# EAGLE design LED-driver (EAGLE 7.1.0)
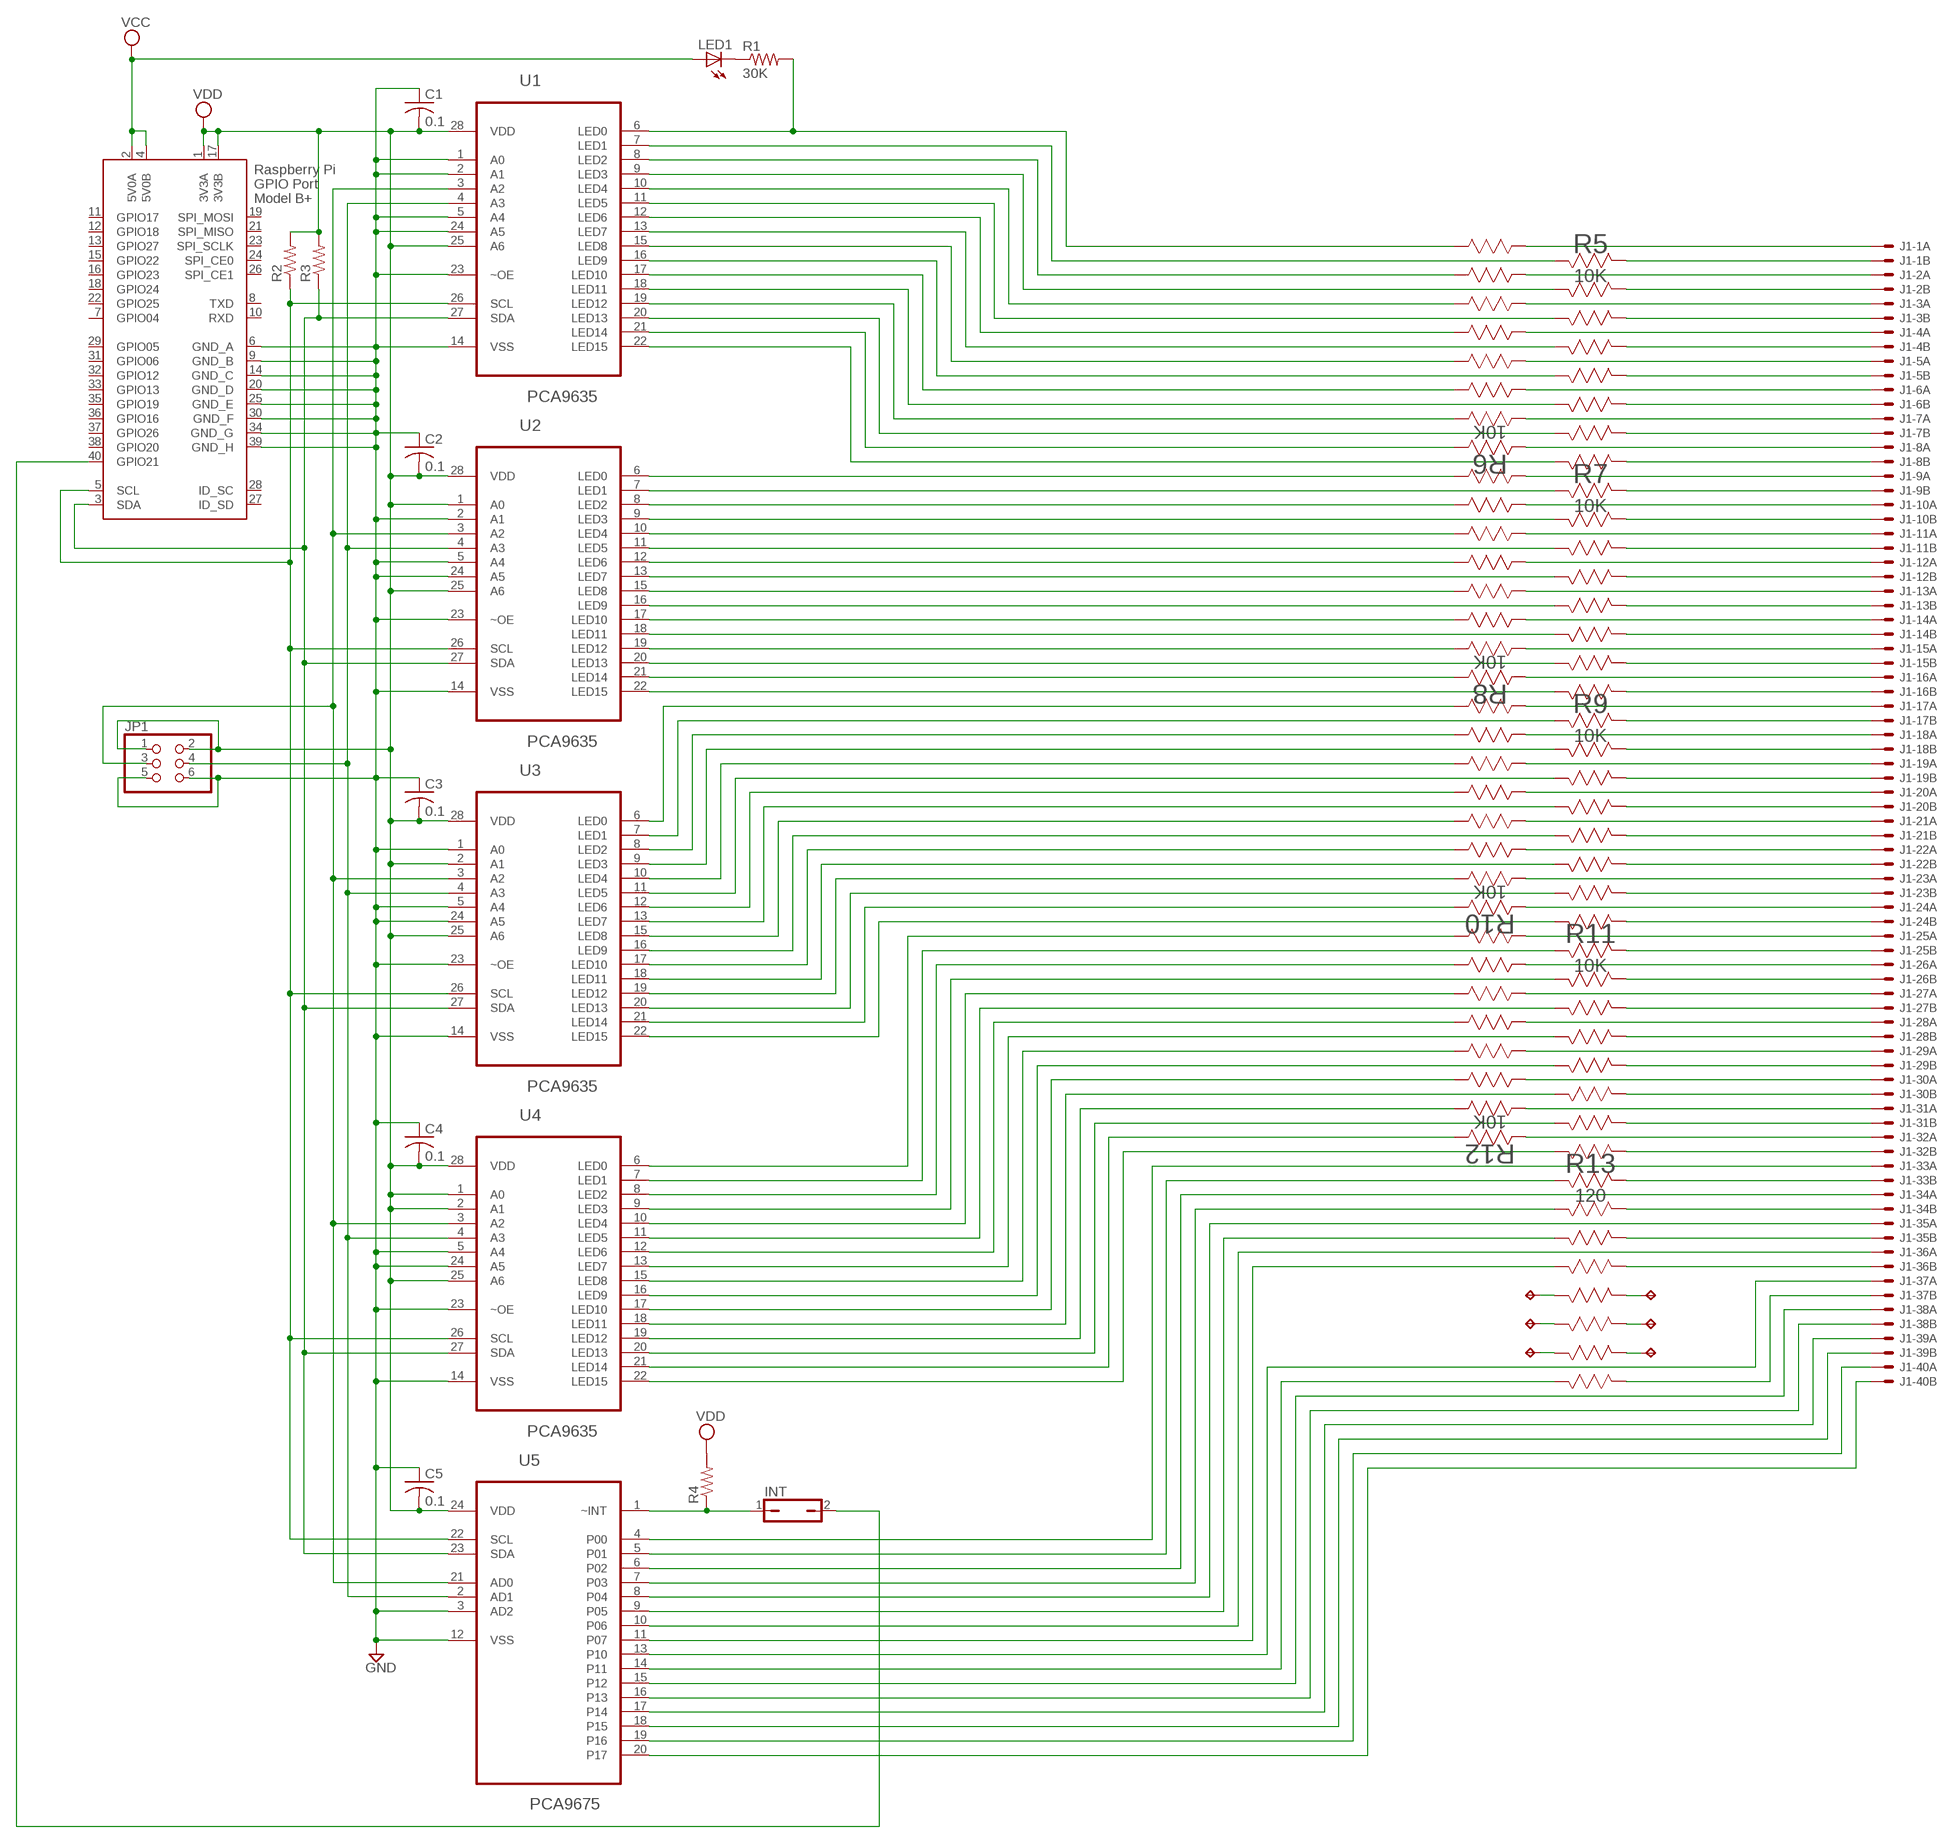
[diagram p0: schematic, sheet 1]

## Parts
C1  0.1  C-US025-030X050  [C025-030X050]
C2  0.1  C-US025-030X050  [C025-030X050]
C3  0.1  C-US025-030X050  [C025-030X050]
C4  0.1  C-US025-030X050  [C025-030X050]
C5  0.1  C-US025-030X050  [C025-030X050]
INT  JP1Q  [JP1]
J1  CON-80-EDGE  [CARDEDGE-80]
JP1  JUMPER-3X2  [3X2]
LED1  LED5MM  [LED5MM]
R1  30K  R-US_0207/10  [0207/10]
R2  R-US_0207/10  [0207/10]
R3  R-US_0207/10  [0207/10]
R4  R-US_0207/10  [0207/10]
R5  10K  CTS  [SOMC16-M]
R6  10K  CTS  [SOMC16-M]
R7  10K  CTS  [SOMC16-M]
R8  10K  CTS  [SOMC16-M]
R9  10K  CTS  [SOMC16-M]
R10  10K  CTS  [SOMC16-M]
R11  10K  CTS  [SOMC16-M]
R12  10K  CTS  [SOMC16-M]
R13  120  CTS  [SOMC16-M]
TP1  TP  [TP]
TP2  TP  [TP]
TP3  TP  [TP]
TP4  TP  [TP]
TP5  TP  [TP]
TP6  TP  [TP]
U1  PCA9635  [SOP65P640X110-28N]
U2  PCA9635  [SOP65P640X110-28N]
U3  PCA9635  [SOP65P640X110-28N]
U4  PCA9635  [SOP65P640X110-28N]
U5  PCA9675  [SOP65P640X110-24N]
X1  RASPI_BOARD_B+#_E4  [RASPI_BOARD_B+_EDGES_4DRILL]

## Nets
GND: C1.1 C2.1 C3.1 C4.1 C5.1 JP1.5 JP1.6 U1.1(A0) U1.2(A1) U1.5(A4) U1.14(VSS) U1.23(~OE) U1.24(A5) U2.2(A1) U2.5(A4) U2.14(VSS) U2.23(~OE) U2.24(A5) U3.1(A0) U3.5(A4) U3.14(VSS) U3.23(~OE) U3.24(A5) U4.5(A4) U4.14(VSS) U4.23(~OE) U4.24(A5) U5.3(AD2) U5.12(VSS) X1.6(GND_A) X1.9(GND_B) X1.14(GND_C) X1.20(GND_D) X1.25(GND_E) X1.30(GND_F) X1.34(GND_G) X1.39(GND_H)
N$1: R1.2 R6.9 U1.6(LED0)
N$2: R5.16 U1.7(LED1)
N$3: R6.10 U1.8(LED2)
N$4: R5.15 U1.9(LED3)
N$5: R6.11 U1.10(LED4)
N$6: R5.14 U1.11(LED5)
N$7: R6.12 U1.12(LED6)
N$8: R5.13 U1.13(LED7)
N$9: R6.13 U1.15(LED8)
N$10: R5.12 U1.16(LED9)
N$11: R6.14 U1.17(LED10)
N$12: R5.11 U1.18(LED11)
N$13: R6.15 U1.19(LED12)
N$14: R5.10 U1.20(LED13)
N$15: R6.16 U1.21(LED14)
N$16: R5.9 U1.22(LED15)
N$17: J1.36A U5.10(P06)
N$18: R3.1 U1.27(SDA) U2.27(SDA) U3.27(SDA) U4.27(SDA) U5.23(SDA) X1.3(SDA)
N$19: R8.9 U2.6(LED0)
N$20: R2.1 U1.26(SCL) U2.26(SCL) U3.26(SCL) U4.26(SCL) U5.22(SCL) X1.5(SCL)
N$21: R13.13 U5.11(P07)
N$22: R7.16 U2.7(LED1)
N$23: R8.10 U2.8(LED2)
N$24: R7.15 U2.9(LED3)
N$25: R8.11 U2.10(LED4)
N$26: R7.14 U2.11(LED5)
N$27: R8.12 U2.12(LED6)
N$28: R7.13 U2.13(LED7)
N$29: R8.13 U2.15(LED8)
N$30: R7.12 U2.16(LED9)
N$31: R8.14 U2.17(LED10)
N$32: R7.11 U2.18(LED11)
N$33: R8.15 U2.19(LED12)
N$34: R7.10 U2.20(LED13)
N$35: R8.16 U2.21(LED14)
N$36: R7.9 U2.22(LED15)
N$37: R10.9 U3.6(LED0)
N$38: R9.16 U3.7(LED1)
N$39: R10.10 U3.8(LED2)
N$40: R9.15 U3.9(LED3)
N$41: R10.11 U3.10(LED4)
N$42: R9.14 U3.11(LED5)
N$43: R10.12 U3.12(LED6)
N$44: R9.13 U3.13(LED7)
N$45: R10.13 U3.15(LED8)
N$46: R9.12 U3.16(LED9)
N$47: R10.14 U3.17(LED10)
N$48: R9.11 U3.18(LED11)
N$49: R10.15 U3.19(LED12)
N$50: R9.10 U3.20(LED13)
N$51: R10.16 U3.21(LED14)
N$52: R9.9 U3.22(LED15)
N$53: R12.9 U4.6(LED0)
N$54: R11.16 U4.7(LED1)
N$55: R12.10 U4.8(LED2)
N$56: R11.15 U4.9(LED3)
N$57: R12.11 U4.10(LED4)
N$58: R11.14 U4.11(LED5)
N$59: R12.12 U4.12(LED6)
N$60: R11.13 U4.13(LED7)
N$61: R12.13 U4.15(LED8)
N$62: R11.12 U4.16(LED9)
N$63: R12.14 U4.17(LED10)
N$64: R11.11 U4.18(LED11)
N$65: R12.15 U4.19(LED12)
N$66: R11.10 U4.20(LED13)
N$67: R12.16 U4.21(LED14)
N$68: R11.9 U4.22(LED15)
N$69: J1.33A U5.4(P00)
N$70: R13.16 U5.5(P01)
N$71: J1.34A U5.6(P02)
N$72: R13.15 U5.7(P03)
N$73: J1.35A U5.8(P04)
N$74: R13.14 U5.9(P05)
N$75: JP1.3 U1.3(A2) U2.3(A2) U3.3(A2) U4.3(A2) U5.21(AD0)
N$76: JP1.4 U1.4(A3) U2.4(A3) U3.4(A3) U4.4(A3) U5.2(AD1)
N$77: J1.37A U5.13(P10)
N$78: R13.9 U5.14(P11)
N$79: J1.38A U5.15(P12)
N$80: J1.38B U5.16(P13)
N$81: J1.39A U5.17(P14)
N$82: J1.39B U5.18(P15)
N$83: J1.40A U5.19(P16)
N$84: J1.40B U5.20(P17)
N$85: LED1.K(C) R1.1
N$86: J1.1A R6.8
N$87: J1.2A R6.7
N$88: INT.1 R4.1 U5.1(~INT)
N$89: INT.2 X1.40(GPIO21)
N$90: J1.3A R6.6
N$91: J1.4A R6.5
N$92: J1.5A R6.4
N$93: J1.6A R6.3
N$94: J1.7A R6.2
N$95: J1.8A R6.1
N$96: J1.1B R5.1
N$97: J1.2B R5.2
N$98: J1.3B R5.3
N$99: J1.4B R5.4
N$100: J1.5B R5.5
N$101: J1.6B R5.6
N$102: J1.7B R5.7
N$103: J1.8B R5.8
N$104: J1.9B R7.1
N$105: J1.10B R7.2
N$106: J1.11B R7.3
N$107: J1.12B R7.4
N$108: J1.13B R7.5
N$109: J1.14B R7.6
N$110: J1.15B R7.7
N$111: J1.16B R7.8
N$112: J1.9A R8.8
N$113: J1.10A R8.7
N$114: J1.11A R8.6
N$115: J1.12A R8.5
N$116: J1.13A R8.4
N$117: J1.14A R8.3
N$118: J1.15A R8.2
N$119: J1.16A R8.1
N$120: J1.17B R9.1
N$121: J1.18B R9.2
N$122: J1.19B R9.3
N$123: J1.20B R9.4
N$124: J1.21B R9.5
N$125: J1.22B R9.6
N$126: J1.23B R9.7
N$127: J1.24B R9.8
N$128: J1.25B R11.1
N$129: J1.26B R11.2
N$130: J1.27B R11.3
N$131: J1.28B R11.4
N$132: J1.29B R11.5
N$133: J1.30B R11.6
N$134: J1.31B R11.7
N$135: J1.32B R11.8
N$136: J1.33B R13.1
N$137: J1.34B R13.2
N$138: J1.35B R13.3
N$139: J1.36B R13.4
N$140: J1.37B R13.8
N$141: J1.17A R10.8
N$142: J1.18A R10.7
N$143: J1.19A R10.6
N$144: J1.20A R10.5
N$145: J1.21A R10.4
N$146: J1.22A R10.3
N$147: J1.23A R10.2
N$148: J1.24A R10.1
N$149: J1.25A R12.8
N$150: J1.26A R12.7
N$151: J1.27A R12.6
N$152: J1.28A R12.5
N$153: J1.29A R12.4
N$154: J1.30A R12.3
N$155: J1.31A R12.2
N$156: J1.32A R12.1
N$157: R13.12 TP1.1(TP)
N$158: R13.11 TP2.1(TP)
N$159: R13.10 TP3.1(TP)
N$160: R13.5 TP4.1(TP)
N$161: R13.6 TP5.1(TP)
N$162: R13.7 TP6.1(TP)
VCC: LED1.A X1.2(5V0A) X1.4(5V0B)
VDD: C1.2 C2.2 C3.2 C4.2 C5.2 JP1.1 JP1.2 R2.2 R3.2 R4.2 U1.25(A6) U1.28(VDD) U2.1(A0) U2.25(A6) U2.28(VDD) U3.2(A1) U3.25(A6) U3.28(VDD) U4.1(A0) U4.2(A1) U4.25(A6) U4.28(VDD) U5.24(VDD) X1.1(3V3A) X1.17(3V3B)
Unconnected: X1.7(GPIO04) X1.8(TXD) X1.10(RXD) X1.11(GPIO17) X1.12(GPIO18) X1.13(GPIO27) X1.15(GPIO22) X1.16(GPIO23) X1.18(GPIO24) X1.19(SPI_MOSI) X1.21(SPI_MISO) X1.22(GPIO25) X1.23(SPI_SCLK) X1.24(SPI_CE0) X1.26(SPI_CE1) X1.27(ID_SD) X1.28(ID_SC) X1.29(GPIO05) X1.31(GPIO06) X1.32(GPIO12) X1.33(GPIO13) X1.35(GPIO19) X1.36(GPIO16) X1.37(GPIO26) X1.38(GPIO20)

## Library data of the parts
C1-C5 = resistor:C-US: CAPACITOR, American symbol
INT = jumper:JP1Q: JUMPER
J1 = card-edge-80:CON-80: Connector 80-pin
JP1 = Casner:JUMPER-3X2: JUMPER PATTERN
LED1 = led:LED: LED OSRAM: - CHIPLED LG R971, LG N971, LY N971, LG Q971, LY Q971, LO R971, LY R971 LH N974, LH R974 LS Q976, LO Q976, LY Q976 LO Q996 - Hyper CHIPLED LW Q18S LB Q993, LB Q99A, LB R99A - SideLED LS A670, LO A670, LY A670, LG A670, LP A670 LB A673, LV A673, LT A673, LW A673 LH A674 LY A675 LS A676, LA A676, LO A676, LY A676, LW A676 LS A679, LY A679, LG A679 - Hyper Micro SIDELED® LS Y876, LA Y876, LO Y876, LY Y876 LT Y87S - SmartLED LW L88C, LW L88S LB L89C, LB L89S, LG L890 LS L89K, LO L89K, LY L89K LS L896, LA L896, LO L896, LY L896 - TOPLED LS T670, LO T670, LY T670, LG T670, LP T670 LSG T670, LSP T670, LSY T670, LOP T670, LYG T670 LG T671, LOG T671, LSG T671 LB T673, LV T673, LT T673, LW T673 LH T674 LS T676, LA T676, LO T676, LY T676, LB T676, LH T676, LSB T676, LW T676 LB T67C, LV T67C, LT T67C, LS T67K, LO T67K, LY T67K, LW E67C LS E67B, LA E67B, LO E67B, LY E67B, LB E67C, LV E67C, LT E67C LW T67C LS T679, LY T679, LG T679 LS T770, LO T770, LY T770, LG T770, LP T770 LB T773, LV T773, LT T773, LW T773 LH T774 LS E675, LA E675, LY E675, LS T675 LS T776, LA T776, LO T776, LY T776, LB T776 LHGB T686 LT T68C, LB T68C - Hyper Mini TOPLED® LB M676 - Mini TOPLED Santana® LG M470 LS M47K, LO M47K, LY M47K Source: http://www.osram.convergy.de LUXEON: - LUMILED® LXK2-PW12-R00, LXK2-PW12-S00, LXK2-PW14-U00, LXK2-PW14-V00 LXK2-PM12-R00, LXK2-PM12-S00, LXK2-PM14-U00 LXK2-PE12-Q00, LXK2-PE12-R00, LXK2-PE12-S00, LXK2-PE14-T00, LXK2-PE14-U00 LXK2-PB12-K00, LXK2-PB12-L00, LXK2-PB12-M00, LXK2-PB14-N00, LXK2-PB14-P00, LXK2-PB14-Q00 LXK2-PR12-L00, LXK2-PR12-M00, LXK2-PR14-Q00, LXK2-PR14-R00 LXK2-PD12-Q00, LXK2-PD12-R00, LXK2-PD12-S00 LXK2-PH12-R00, LXK2-PH12-S00 LXK2-PL12-P00, LXK2-PL12-Q00, LXK2-PL12-R00 Source: www.luxeon.com KINGBRIGHT: KA-3528ASYC Source: www.kingbright.com
R1-R4 = resistor:R-US_: RESISTOR, American symbol
R5-R13 = resistor-array:CTS
TP1-TP6 = Casner:TP
U1-U4 = NXP_By_element14_Batch_1:PCA9635: 16-bit Fm+ I2C-bus LED driver; MPN: PCA9635PW,112; OC_FARNELL: 1868310; OC_NEWARK: 70R6739; PACKAGE: 70R6739; SUPPLIER: NXP
U5 = NXP_By_element14_Batch_1:PCA9675: Remote 16-bit I/O expander for I2C-bus with interrupt; MPN: PCA9675PW,112; OC_FARNELL: -; OC_NEWARK: 70R6423; PACKAGE: TSSOP-24; SUPPLIER: NXP
X1 = raspberrypi_bastelstube_v13:RASPI_BOARD_B+#: Raspberry Pi GPIO connector with markings for the outer dimensions of the Raspberry Pi board model B+ with different sets of drill holes or mounting pads All pins connected

## Board
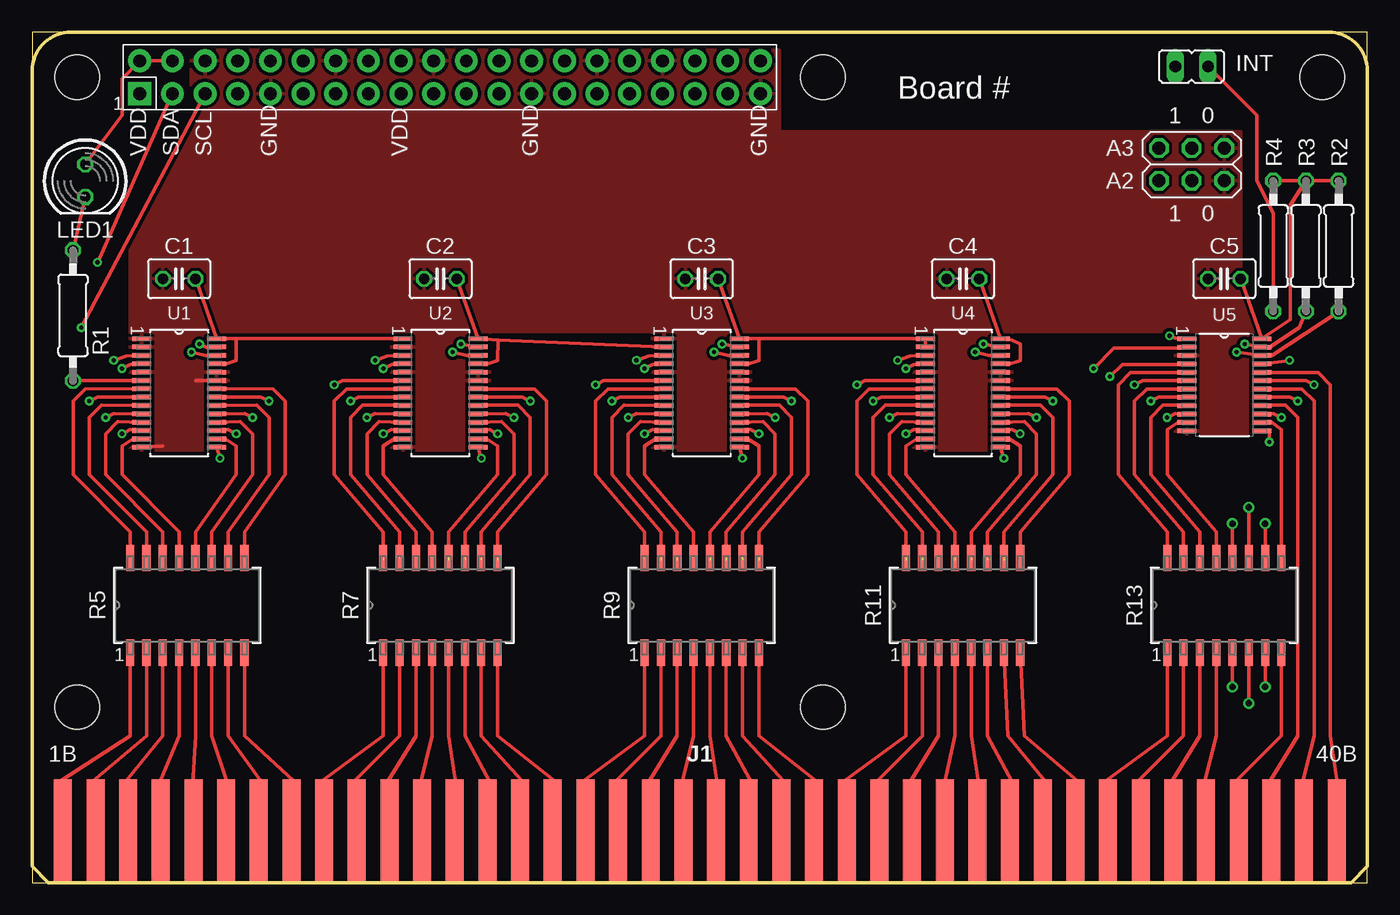
[diagram p1: board, top side]
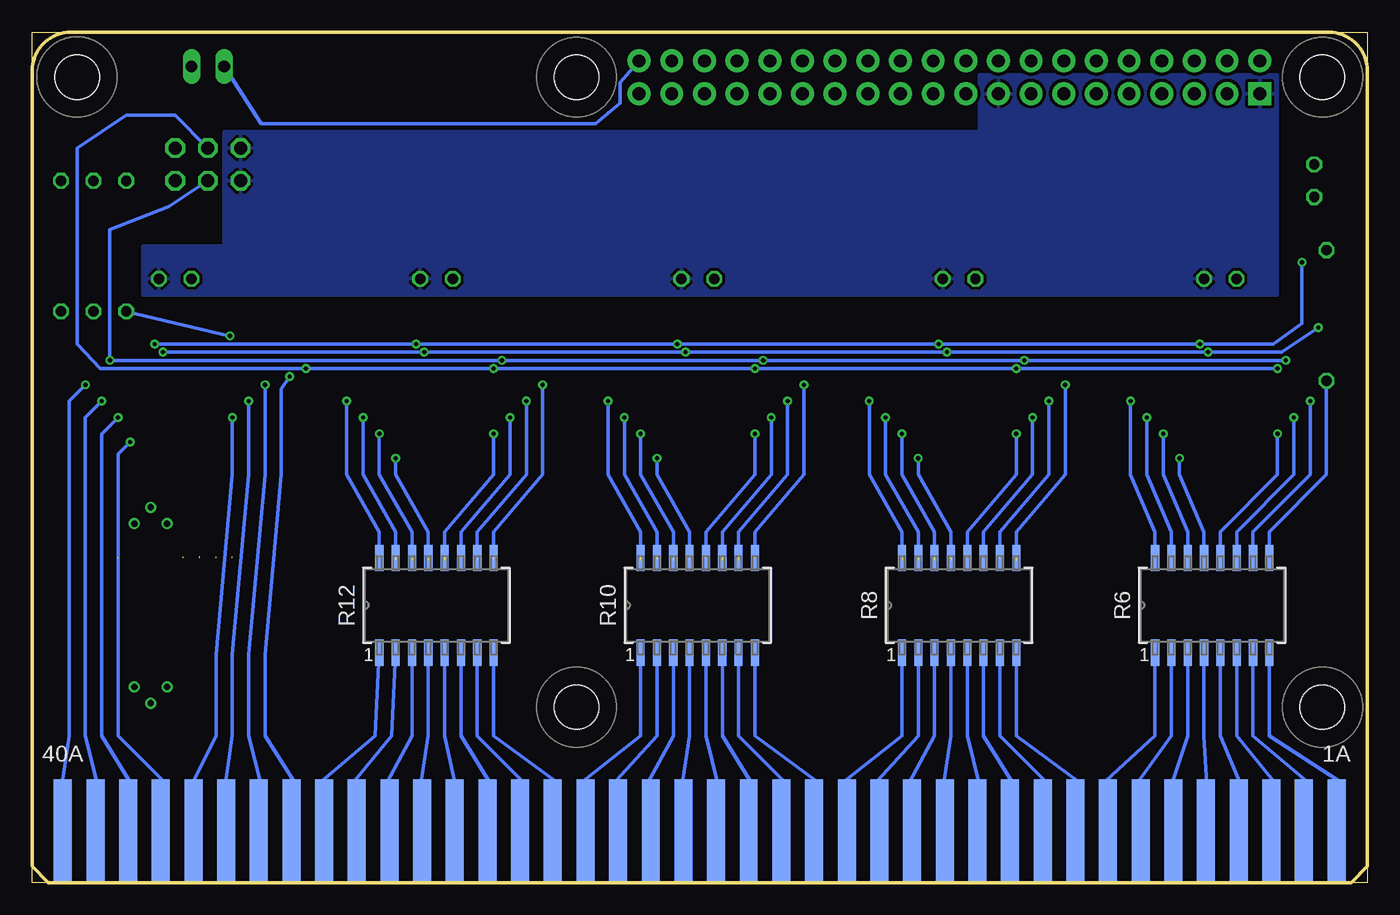
[diagram p2: board, bottom side, seen from below]

Size 103.84 x 66.17 mm. Coordinates in mm from the lower left corner, seen from the top.
Outline: 1.27,0 0,0 0,1.27
Outline: 102.56,0 103.83,0 103.83,1.27
Outline: 0,1.27 0,63.17 0,66.17 3,66.17 100.83,66.17 103.83,66.17 103.83,63.17 103.83,1.27
Outline: 0,1.27 1.27,0
Outline: 1.27,0 102.56,0
Outline: 102.56,0 103.83,1.27
Copper layers (1*16): Top 0.0356mm / dielectric 1.5011mm / Bottom 0.0356mm
Design rules "oshpark-2layer": minimum track width 6mil, minimum drill 13mil, track to track 6mil, track to pad 6mil, pad to pad 6mil, via to via 6mil, smd to smd 6mil, copper to edge 15mil, drill to drill 6mil, minimum pad ring 7mil, minimum via ring 7mil, stop-mask expansion 2.5mil, vias tented up to drill 0mil, thermal gap 10mil
Holes 3.45 mm at 100.34,62.67

### Footprints (pad centres in the part's own frame; a part is rotated, then mirrored left to right if it is on the bottom)
C025-030X050 = drill 0.813 octagon: 1 -1.27,0; 2 1.27,0
JP1 = drill 0.914 long: 1 0,-1.27; 2 0,1.27
CARDEDGE-80 = smd 1.397 x 8.001 bottom: 1A -43.18,4.064; 2A -40.64,4.064; 3A -38.1,4.064; 4A -35.56,4.064; 5A -33.02,4.064; 6A -30.48,4.064; 7A -27.94,4.064; 8A -25.4,4.064; 9A -22.86,4.064; 10A -20.32,4.064; 11A -17.78,4.064; 12A -15.24,4.064; 13A -12.7,4.064; 14A -10.16,4.064; 15A -7.62,4.064; 16A -5.08,4.064; 17A -2.54,4.064; 18A 0,4.064; 19A 2.54,4.064; 20A 5.08,4.064; 21A 7.62,4.064; 22A 10.16,4.064; 23A 12.7,4.064; 24A 15.24,4.064; 25A 17.78,4.064; 26A 20.32,4.064; 27A 22.86,4.064; 28A 25.4,4.064; 29A 27.94,4.064; 30A 30.48,4.064; 31A 33.02,4.064; 32A 35.56,4.064; 33A 38.1,4.064; 34A 40.64,4.064; 35A 43.18,4.064; 36A 45.72,4.064; 37A 48.26,4.064; 38A 50.8,4.064; 39A 53.34,4.064; 40A 55.88,4.064 | smd 1.397 x 8.001: 1B -43.18,4.064; 2B -40.64,4.064; 3B -38.1,4.064; 4B -35.56,4.064; 5B -33.02,4.064; 6B -30.48,4.064; 7B -27.94,4.064; 8B -25.4,4.064; 9B -22.86,4.064; 10B -20.32,4.064; 11B -17.78,4.064; 12B -15.24,4.064; 13B -12.7,4.064; 14B -10.16,4.064; 15B -7.62,4.064; 16B -5.08,4.064; 17B -2.54,4.064; 18B 0,4.064; 19B 2.54,4.064; 20B 5.08,4.064; 21B 7.62,4.064; 22B 10.16,4.064; 23B 12.7,4.064; 24B 15.24,4.064; 25B 17.78,4.064; 26B 20.32,4.064; 27B 22.86,4.064; 28B 25.4,4.064; 29B 27.94,4.064; 30B 30.48,4.064; 31B 33.02,4.064; 32B 35.56,4.064; 33B 38.1,4.064; 34B 40.64,4.064; 35B 43.18,4.064; 36B 45.72,4.064; 37B 48.26,4.064; 38B 50.8,4.064; 39B 53.34,4.064; 40B 55.88,4.064
3X2 = drill 1.016 octagon: 1 -2.54,-1.27; 2 -2.54,1.27; 3 0,-1.27; 4 0,1.27; 5 2.54,-1.27; 6 2.54,1.27
LED5MM = drill 0.813 octagon: A -1.27,0; K 1.27,0
0207/10 = drill 0.813 octagon: 1 -5.08,0; 2 5.08,0
SOMC16-M = smd 2.03 x 0.63: 1 -3.685,4.445; 2 -3.685,3.175; 3 -3.685,1.905; 4 -3.685,0.635; 5 -3.685,-0.635; 6 -3.685,-1.905; 7 -3.685,-3.175; 8 -3.685,-4.445; 9 3.685,-4.445; 10 3.685,-3.175; 11 3.685,-1.905; 12 3.685,-0.635; 13 3.685,0.635; 14 3.685,1.905; 15 3.685,3.175; 16 3.685,4.445
TP = drill 0.5: 1 0,0
SOP65P640X110-28N = smd 1.473 x 0.356: 1 -2.921,4.216; 2 -2.921,3.581; 3 -2.921,2.921; 4 -2.921,2.286; 5 -2.921,1.626; 6 -2.921,0.965; 7 -2.921,0.33; 8 -2.921,-0.33; 9 -2.921,-0.965; 10 -2.921,-1.626; 11 -2.921,-2.286; 12 -2.921,-2.921; 13 -2.921,-3.581; 14 -2.921,-4.216; 15 2.921,-4.216; 16 2.921,-3.581; 17 2.921,-2.921; 18 2.921,-2.286; 19 2.921,-1.626; 20 2.921,-0.965; 21 2.921,-0.33; 22 2.921,0.33; 23 2.921,0.965; 24 2.921,1.626; 25 2.921,2.286; 26 2.921,2.921; 27 2.921,3.581; 28 2.921,4.216
SOP65P640X110-24N = smd 1.473 x 0.356: 1 -2.921,3.581; 2 -2.921,2.921; 3 -2.921,2.286; 4 -2.921,1.626; 5 -2.921,0.965; 6 -2.921,0.33; 7 -2.921,-0.33; 8 -2.921,-0.965; 9 -2.921,-1.626; 10 -2.921,-2.286; 11 -2.921,-2.921; 12 -2.921,-3.581; 13 2.921,-3.581; 14 2.921,-2.921; 15 2.921,-2.286; 16 2.921,-1.626; 17 2.921,-0.965; 18 2.921,-0.33; 19 2.921,0.33; 20 2.921,0.965; 21 2.921,1.626; 22 2.921,2.286; 23 2.921,2.921; 24 2.921,3.581
RASPI_BOARD_B+_EDGES_4DRILL = drill 1 pad 1.778 square: 1 8.37,51.23 | drill 1 pad 1.778: 2 8.37,53.77; 3 10.91,51.23; 4 10.91,53.77; 5 13.45,51.23; 6 13.45,53.77; 7 15.99,51.23; 8 15.99,53.77; 9 18.53,51.23; 10 18.53,53.77; 11 21.07,51.23; 12 21.07,53.77; 13 23.61,51.23; 14 23.61,53.77; 15 26.15,51.23; 16 26.15,53.77; 17 28.69,51.23; 18 28.69,53.77; 19 31.23,51.23; 20 31.23,53.77; 21 33.77,51.23; 22 33.77,53.77; 23 36.31,51.23; 24 36.31,53.77; 25 38.85,51.23; 26 38.85,53.77; 27 41.39,51.23; 28 41.39,53.77; 29 43.93,51.23; 30 43.93,53.77; 31 46.47,51.23; 32 46.47,53.77; 33 49.01,51.23; 34 49.01,53.77; 35 51.55,51.23; 36 51.55,53.77; 37 54.09,51.23; 38 54.09,53.77; 39 56.63,51.23; 40 56.63,53.77 | hole 3.454: 3.5,3.5; 3.5,52.5; 61.5,3.5; 61.5,52.5

### Placement (x,y rotation side)
C1  11.43,46.99 0 top
C2  31.75,46.99 0 top
C3  52.07,46.99 0 top
C4  72.39,46.99 0 top
C5  92.71,46.99 0 top
INT  90.17,63.5 90 top
J1  45.57,0 0 top
JP1  90.17,55.88 0 top
LED1  4.13,54.61 270 top
R1  3.17,44.13 270 top
R2  101.6,49.53 90 top
R3  99.06,49.53 90 top
R4  96.52,49.53 90 top
R5  12.06,21.59 90 top
R6  12.06,21.59 90 bottom
R7  31.75,21.59 90 top
R8  31.75,21.59 90 bottom
R9  52.07,21.59 90 top
R10  52.07,21.59 90 bottom
R11  72.39,21.59 90 top
R12  72.39,21.59 90 bottom
R13  92.71,21.59 90 top
TP1  93.34,27.94 0 top
TP2  94.61,29.21 0 top
TP3  95.89,27.94 0 top
TP4  93.34,15.24 0 top
TP5  94.61,13.97 0 top
TP6  95.89,15.24 0 top
U1  11.43,38.1 0 top
U2  31.75,38.1 0 top
U3  52.07,38.1 0 top
U4  72.39,38.1 0 top
U5  92.71,38.73 0 top
X1  0,10.16 0 top

### Tracks (layer width: path | path; a pad name or v marks a point on that pad's centre or on a via)
GND
  Top 0.254: U1.14 10.16,33.97 | U1.23 12.7,39.05
  pour Top (isolate 0.254): 12.38,64.77 58.1,64.77 58.1,58.42 93.98,58.42 93.98,45.72 96.52,45.72 96.52,34.92 88.9,34.92 88.9,42.86 76.2,42.86 76.2,33.66 68.58,33.66 68.58,42.86 55.88,42.86 55.88,33.66 48.26,33.66 48.26,42.86 35.56,42.86 35.56,33.66 27.94,33.66 27.94,42.86 15.24,42.86 15.24,33.66 7.62,33.66 7.62,49.53 12.38,59.69
N$1
  Top 0.254: U1.6 R1.2
  Bottom 0.254: R1.2 3.17,31.75 7.62,27.3 R6.9
N$2
  Top 0.254: U1.7 4.13,38.42 3.17,37.47 3.17,31.75 7.62,27.3 R5.16
N$3  (via drill 0.33)
  Top 0.254: U1.8 5.08,37.78 v4.45,37.47
  Bottom 0.254: v4.45,37.47 4.45,31.75 8.89,27.3 R6.10
N$4
  Top 0.254: U1.9 5.4,37.15 4.45,36.2 4.45,31.75 8.89,27.3 R5.15
N$5  (via drill 0.33)
  Top 0.254: U1.10 6.35,36.51 v5.71,36.2
  Bottom 0.254: v5.71,36.2 5.71,31.75 10.16,27.3 R6.11
N$6
  Top 0.254: U1.11 6.67,35.88 5.71,34.92 5.71,31.75 10.16,27.3 R5.14
N$7  (via drill 0.33)
  Top 0.254: U1.12 7.62,35.24 v6.99,34.92
  Bottom 0.254: v6.99,34.92 6.99,31.75 11.43,27.3 R6.12
N$8
  Top 0.254: U1.13 7.94,34.61 6.99,33.97 6.99,31.75 11.43,27.3 R5.13
N$9  (via drill 0.33)
  Top 0.254: U1.15 v14.61,33.02
  Bottom 0.254: v14.61,33.02 14.61,31.75 12.7,27.3 R6.13
N$10
  Top 0.254: U1.16 14.92,34.61 15.88,33.97 15.88,31.75 12.7,27.3 R5.12
N$11  (via drill 0.33)
  Top 0.254: U1.17 15.24,35.24 v15.88,34.92
  Bottom 0.254: v15.88,34.92 15.88,31.75 13.97,27.3 R6.14
N$12
  Top 0.254: U1.18 16.19,35.88 17.14,34.92 17.14,31.75 13.97,27.3 R5.11
N$13  (via drill 0.33)
  Top 0.254: U1.19 16.51,36.51 v17.14,36.2
  Bottom 0.254: v17.14,36.2 17.14,31.75 15.24,27.3 R6.15
N$14
  Top 0.254: U1.20 17.46,37.15 18.41,36.2 18.41,31.75 15.24,27.3 R5.10
N$15  (via drill 0.33)
  Top 0.254: U1.21 17.78,37.78 v18.41,37.47
  Bottom 0.254: v18.41,37.47 18.41,31.75 16.51,27.3 R6.16
N$16
  Top 0.254: U1.22 18.73,38.42 19.68,37.47 19.68,31.75 16.51,27.3 R5.9
N$17  (via drill 0.33)
  Top 0.254: U5.10 88.9,36.51 v88.27,36.2
  Bottom 0.254: v88.27,36.2 88.27,31.75 89.53,17.78 89.53,11.43 91.44,7.62 J1.36A
N$18  (via drill 0.33)
  Top 0.254: X1.3 v5.08,48.26 | U2.27 v33.34,41.91 | U3.27 v53.66,41.91 | U4.27 v73.98,41.91 | v13.02,41.91 13.65,41.59 U1.27 | v94.3,41.91 U5.23 96.27,41.66 98.55,43.18 R3.1
  Bottom 0.254: v5.08,48.26 5.08,43.5 7.3,41.91 v13.02,41.91 v33.34,41.91 v53.66,41.91 v73.98,41.91 v94.3,41.91
N$19  (via drill 0.33)  (1 unrouted)
  Top 0.254: U2.6 24.13,39.05 v23.5,38.73
  Bottom 0.254: v23.5,38.73 23.5,31.75 27.3,27.3 27.3,25.08
N$20  (via drill 0.33)
  Top 0.254: X1.5 v3.81,43.18 | v12.38,41.27 13.65,40.96 U1.26 | U2.26 33.97,40.96 v32.7,41.27 | U3.26 54.29,40.96 v53.02,41.27 | U4.26 74.61,40.96 v73.34,41.27 | v93.66,41.27 U5.22 96.39,41.02 R2.1
  Bottom 0.254: v3.81,43.18 6.67,41.27 v12.38,41.27 v32.7,41.27 v53.02,41.27 v73.34,41.27 v93.66,41.27
N$21  (1 unrouted)
  Top 0.254: U5.11 89.22,35.88 88.27,35.24 88.27,31.75 92.08,27.3 92.08,25.4
N$22
  Top 0.254: U2.7 28.26,38.42 24.45,38.42 23.5,37.47 23.5,31.75 27.3,27.3 R7.16
N$23  (via drill 0.33)  (1 unrouted)
  Top 0.254: U2.8 28.26,37.78 25.4,37.78 v24.77,37.47
  Bottom 0.254: v24.77,37.47 24.77,31.75 28.57,27.3 28.57,25.4
N$24  (1 unrouted)
  Top 0.254: U2.9 28.26,37.15 25.72,37.15 24.77,36.2 24.77,31.75 28.57,27.3 28.57,25.4
N$25  (via drill 0.33)  (1 unrouted)
  Top 0.254: U2.10 26.67,36.51 v26.04,36.2
  Bottom 0.254: v26.04,36.2 26.04,31.75 29.84,27.3 29.84,25.4
N$26  (1 unrouted)
  Top 0.254: U2.11 26.99,35.88 26.04,34.92 26.04,31.75 29.84,27.3 29.84,25.4
N$27  (via drill 0.33)  (1 unrouted)
  Top 0.254: U2.12 27.94,35.24 v27.3,34.92
  Bottom 0.254: v27.3,34.92 27.3,31.75 31.11,27.3 31.11,25.4
N$28  (1 unrouted)
  Top 0.254: U2.13 28.26,34.61 27.3,33.97 27.3,31.75 31.11,27.3 31.11,25.4
N$29  (via drill 0.33)  (1 unrouted)
  Top 0.254: U2.15 v34.92,33.02
  Bottom 0.254: v34.92,33.02 34.92,31.75 32.38,27.3 32.38,25.08
N$30  (1 unrouted)
  Top 0.254: U2.16 35.24,34.61 36.2,33.97 36.2,31.75 32.38,27.3 32.38,25.4
N$31  (via drill 0.33)  (1 unrouted)
  Top 0.254: U2.17 35.56,35.24 v36.2,34.92
  Bottom 0.254: v36.2,34.92 36.2,31.75 33.66,27.3 33.66,25.4
N$32  (1 unrouted)
  Top 0.254: U2.18 36.51,35.88 37.47,34.92 37.47,31.75 33.66,27.3 33.66,25.08
N$33  (via drill 0.33)  (1 unrouted)
  Top 0.254: U2.19 36.83,36.51 v37.47,36.2
  Bottom 0.254: v37.47,36.2 37.47,31.75 34.92,27.3 34.92,25.08
N$34  (1 unrouted)
  Top 0.254: U2.20 35.24,37.15 37.78,37.15 38.73,36.2 38.73,31.75 34.92,27.3 34.92,25.08
N$35  (via drill 0.33)  (1 unrouted)
  Top 0.254: U2.21 35.24,37.78 38.1,37.78 v38.73,37.47
  Bottom 0.254: v38.73,37.47 38.73,31.75 36.2,27.3 36.2,25.08
N$36  (1 unrouted)
  Top 0.254: U2.22 35.24,38.42 39.05,38.42 40.01,37.47 40.01,31.75 36.2,27.3 36.2,25.08
N$37  (via drill 0.33)  (1 unrouted)
  Top 0.254: U3.6 48.58,39.05 44.45,39.05 v43.81,38.73
  Bottom 0.254: v43.81,38.73 43.81,31.75 47.62,27.3 47.62,25.4
N$38  (1 unrouted)
  Top 0.254: U3.7 48.58,38.42 44.77,38.42 43.81,37.47 43.81,31.75 47.62,27.3 47.62,25.4
N$39  (via drill 0.33)  (1 unrouted)
  Top 0.254: U3.8 48.58,37.78 45.72,37.78 v45.09,37.47
  Bottom 0.254: v45.09,37.47 45.09,31.75 48.9,27.3 48.9,25.4
N$40  (1 unrouted)
  Top 0.254: U3.9 46.04,37.15 45.09,36.2 45.09,31.75 48.9,27.3 48.9,25.08
N$41  (via drill 0.33)  (1 unrouted)
  Top 0.254: U3.10 46.99,36.51 v46.35,36.2
  Bottom 0.254: v46.35,36.2 46.35,31.75 50.16,27.3 50.16,25.4
N$42  (1 unrouted)
  Top 0.254: U3.11 47.31,35.88 46.35,34.92 46.35,31.75 50.16,27.3 50.16,25.08
N$43  (via drill 0.33)  (1 unrouted)
  Top 0.254: U3.12 48.26,35.24 v47.62,34.92
  Bottom 0.254: v47.62,34.92 47.62,31.75 51.44,27.3 51.44,25.4
N$44  (1 unrouted)
  Top 0.254: U3.13 48.58,34.61 47.62,33.97 47.62,31.75 51.44,27.3 51.44,25.4
N$45  (via drill 0.33)  (1 unrouted)
  Top 0.254: U3.15 v55.24,33.02
  Bottom 0.254: v55.24,33.02 55.24,31.75 52.7,27.3 52.7,25.08
N$46  (1 unrouted)
  Top 0.254: U3.16 55.56,34.61 56.52,33.97 56.52,31.75 52.7,27.3 52.7,25.08
N$47  (via drill 0.33)  (1 unrouted)
  Top 0.254: U3.17 55.88,35.24 v56.52,34.92
  Bottom 0.254: v56.52,34.92 56.52,31.75 53.98,27.3 53.98,25.08
N$48  (1 unrouted)
  Top 0.254: U3.18 56.83,35.88 57.78,34.92 57.78,31.75 53.98,27.3 53.98,25.08
N$49  (via drill 0.33)  (1 unrouted)
  Top 0.254: U3.19 57.15,36.51 v57.78,36.2
  Bottom 0.254: v57.78,36.2 57.78,31.75 55.24,27.3 55.24,25.4
N$50  (1 unrouted)
  Top 0.254: U3.20 55.56,37.15 58.1,37.15 59.05,36.2 59.05,31.75 55.24,27.3 55.24,25.08
N$51  (via drill 0.33)  (1 unrouted)
  Top 0.254: U3.21 55.56,37.78 58.42,37.78 v59.05,37.47
  Bottom 0.254: v59.05,37.47 59.05,31.75 56.52,27.3 56.52,25.4
N$52  (1 unrouted)
  Top 0.254: U3.22 55.56,38.42 59.37,38.42 60.33,37.47 60.33,31.75 56.52,27.3 56.52,25.08
N$53  (via drill 0.33)  (1 unrouted)
  Top 0.254: U4.6 68.9,39.05 64.77,39.05 v64.14,38.73
  Bottom 0.254: v64.14,38.73 64.14,31.75 67.94,27.3 67.94,25.4
N$54  (1 unrouted)
  Top 0.254: U4.7 68.9,38.42 65.09,38.42 64.14,37.47 64.14,31.75 67.94,27.3 67.94,25.08
N$55  (via drill 0.33)
  Top 0.254: U4.8 68.9,37.78 66.04,37.78 v65.41,37.47
  Bottom 0.254: v65.41,37.47 65.41,31.75 69.22,27.3 R12.10
N$56  (1 unrouted)
  Top 0.254: U4.9 68.9,37.15 66.36,37.15 65.41,36.2 65.41,31.75 69.22,27.3 69.22,25.08
N$57  (via drill 0.33)  (1 unrouted)
  Top 0.254: U4.10 67.31,36.51 v66.67,36.2
  Bottom 0.254: v66.67,36.2 66.67,31.75 70.48,27.3 70.48,25.4
N$58  (1 unrouted)
  Top 0.254: U4.11 67.63,35.88 66.67,34.92 66.67,31.75 70.48,27.3 70.48,25.4
N$59  (via drill 0.33)  (1 unrouted)
  Top 0.254: U4.12 68.58,35.24 v67.94,34.92
  Bottom 0.254: v67.94,34.92 67.94,31.75 71.75,27.3 71.75,25.08
N$60  (1 unrouted)
  Top 0.254: U4.13 68.9,34.61 67.94,33.97 67.94,31.75 71.75,27.3 71.75,25.4
N$61  (via drill 0.33)  (1 unrouted)
  Top 0.254: U4.15 v75.56,33.02
  Bottom 0.254: v75.56,33.02 75.56,31.75 73.03,27.3 73.03,25.4
N$62  (1 unrouted)
  Top 0.254: U4.16 75.88,34.61 76.83,33.97 76.83,31.75 73.03,27.3 73.03,25.08
N$63  (via drill 0.33)  (1 unrouted)
  Top 0.254: U4.17 76.2,35.24 v76.83,34.92
  Bottom 0.254: v76.83,34.92 76.83,31.75 74.3,27.3 74.3,25.08
N$64  (1 unrouted)
  Top 0.254: U4.18 77.15,35.88 78.11,34.92 78.11,31.75 74.3,27.3 74.3,25.4
N$65  (via drill 0.33)  (1 unrouted)
  Top 0.254: U4.19 77.47,36.51 v78.11,36.2
  Bottom 0.254: v78.11,36.2 78.11,31.75 75.56,27.3 75.56,25.08
N$66  (1 unrouted)
  Top 0.254: U4.20 75.88,37.15 78.42,37.15 79.38,36.2 79.38,31.75 75.56,27.3 75.56,25.4
N$67  (via drill 0.33)
  Top 0.254: U4.21 75.88,37.78 78.74,37.78 v79.38,37.47
  Bottom 0.254: v79.38,37.47 79.38,31.75 76.83,27.3 R12.16
N$68  (1 unrouted)
  Top 0.254: U4.22 75.88,38.42 79.69,38.42 80.64,37.47 80.64,31.75 76.83,27.3 76.83,25.4
N$69  (via drill 0.33)
  Top 0.254: U5.4 89.22,40.32 84.77,40.32 v83.82,39.37
  Bottom 0.254: v83.82,39.37 84.45,38.42 84.45,31.75 85.72,17.78 85.72,11.43 83.5,7.94 J1.33A
N$70  (1 unrouted)
  Top 0.254: U5.5 89.22,39.69 85.41,39.69 84.45,38.73 84.45,31.75 88.27,27.3 88.27,25.4
N$71  (via drill 0.33)
  Top 0.254: U5.6 89.22,39.05 86.36,39.05 v85.72,38.73
  Bottom 0.254: v85.72,38.73 85.72,31.75 87,17.78 87,11.43 86.04,7.62 J1.34A
N$72  (1 unrouted)
  Top 0.254: U5.7 89.22,38.42 86.68,38.42 85.72,37.47 85.72,31.75 89.53,27.3 89.53,25.4
N$73  (via drill 0.33)
  Top 0.254: U5.8 89.22,37.78 87.63,37.78 v87,37.47
  Bottom 0.254: v87,37.47 87,31.75 88.27,17.78 88.27,11.43 88.9,6.99 J1.35A
N$74  (1 unrouted)
  Top 0.254: U5.9 89.22,37.15 87.95,37.15 87,36.2 87,31.75 90.81,27.3 90.81,25.4
N$75  (via drill 0.33)
  Top 0.254: v67.31,40.64 68.26,40.96 U4.3 | U3.3 47.94,40.96 v46.99,40.64 | U2.3 27.62,40.96 v26.67,40.64 | U1.3 7.3,40.96 v6.35,40.64 | U5.21 v97.79,40.64
  Bottom 0.254: JP1.3 93.22,52.58 97.79,50.8 v97.79,40.64 v67.31,40.64 v46.99,40.64 v26.67,40.64 v6.35,40.64
N$76  (via drill 0.33)
  Top 0.254: v67.94,40.01 68.58,40.32 U4.4 | U3.4 48.26,40.32 v47.62,40.01 | U2.4 27.94,40.32 v27.3,40.01 | U1.4 7.62,40.32 v6.99,40.01 | v82.55,40.01 84.14,41.59 89.22,41.59 U5.2
  Bottom 0.254: JP1.4 92.71,59.69 96.52,59.69 100.33,57.15 100.33,41.91 98.55,40.01 v82.55,40.01 v67.94,40.01 v47.62,40.01 v27.3,40.01 v6.99,40.01
N$77  (via drill 0.33)
  Top 0.254: U5.13 96.2,35.18 v96.2,34.29
  Bottom 0.254: v96.2,34.29 97.16,33.34 97.16,11.43 93.66,7.94 J1.37A
N$78  (1 unrouted)
  Top 0.254: U5.14 96.33,35.88 97.16,35.24 97.16,25.4
N$79  (via drill 0.33)
  Top 0.254: U5.15 96.52,36.51 v97.16,36.2
  Bottom 0.254: v97.16,36.2 98.42,34.92 98.42,11.43 95.89,7.3 J1.38A
N$80
  Top 0.254: U5.16 96.2,37.15 97.47,37.15 98.42,36.2 98.42,11.43 95.89,7.3 J1.38B
N$81  (via drill 0.33)
  Top 0.254: U5.17 96.2,37.78 97.79,37.78 v98.42,37.47
  Bottom 0.254: v98.42,37.47 99.69,36.2 99.69,11.43 98.42,6.35 J1.39A
N$82
  Top 0.254: U5.18 96.2,38.42 98.74,38.42 99.69,37.47 99.69,11.43 98.42,6.35 J1.39B
N$83  (via drill 0.33)
  Top 0.254: U5.19 96.2,39.05 99.06,39.05 v99.69,38.73
  Bottom 0.254: v99.69,38.73 100.97,37.47 100.97,11.43 101.6,6.99 J1.40A
N$84
  Top 0.254: U5.20 96.2,39.69 100.01,39.69 100.97,38.73 100.97,11.43 101.6,6.99 J1.40B
N$85
  Top 0.254: R1.1 LED1.K
N$86
  Bottom 0.254: R6.8 7.62,11.43 2.22,7.94 J1.1A
N$87
  Bottom 0.254: R6.7 8.89,11.43 4.76,7.94 J1.2A
N$88  (via drill 0.33)
  Top 0.254: U5.1 88.9,42.35 v88.46,42.55 | R4.1 96.52,52.07 95.25,54.61 95.25,59.69 INT.1
  Bottom 0.254: v88.46,42.55 R4.1
N$89
  Bottom 0.254: X1.40 58.1,62.23 58.1,60.64 60.01,59.05 86.04,59.05 INT.2
N$90
  Bottom 0.254: R6.6 10.16,11.43 7.3,7.94 J1.3A
N$91
  Bottom 0.254: R6.5 11.43,11.43 9.84,7.62 J1.4A
N$92
  Bottom 0.254: R6.4 12.7,11.43 12.38,5.71 J1.5A
N$93
  Bottom 0.254: R6.3 13.97,11.43 15.56,6.67 J1.6A
N$94
  Bottom 0.254: R6.2 15.24,11.43 17.78,7.94 J1.7A
N$95
  Bottom 0.254: R6.1 16.51,11.43 20.32,7.94 J1.8A
N$96
  Top 0.254: R5.1 7.62,11.43 2.22,7.94 J1.1B
N$97
  Top 0.254: R5.2 8.89,11.43 4.76,7.94 J1.2B
N$98
  Top 0.254: R5.3 10.16,11.43 7.3,7.94 J1.3B
N$99
  Top 0.254: R5.4 11.43,11.43 9.84,7.62 J1.4B
N$100
  Top 0.254: R5.5 12.7,11.43 12.38,5.71 J1.5B
N$101
  Top 0.254: R5.6 13.97,11.43 15.56,6.67 J1.6B
N$102
  Top 0.254: R5.7 15.24,11.43 17.78,7.94 J1.7B
N$103
  Top 0.254: R5.8 16.51,11.43 20.32,7.94 J1.8B
N$104
  Top 0.254: R7.1 27.3,11.43 22.54,7.94 J1.9B
N$105
  Top 0.254: R7.2 28.57,11.43 25.08,7.94 J1.10B
N$106
  Top 0.254: R7.3 29.84,11.43 27.3,7.3 J1.11B
N$107
  Top 0.254: R7.4 31.11,11.43 30.16,7.62 J1.12B
N$108
  Top 0.254: R7.5 32.38,11.43 33.02,7.3 J1.13B
N$109
  Top 0.254: R7.6 33.66,11.43 35.88,7.3 J1.14B
N$110
  Top 0.254: R7.7 34.92,11.43 38.1,7.94 J1.15B
N$111
  Top 0.254: R7.8 36.2,11.43 40.64,7.94 J1.16B
N$112
  Bottom 0.254: R8.8 27.3,11.43 22.54,7.94 J1.9A
N$113
  Bottom 0.254: R8.7 28.57,11.43 25.08,7.94 J1.10A
N$114
  Bottom 0.254: R8.6 29.84,11.43 27.3,7.3 J1.11A
N$115
  Bottom 0.254: R8.5 31.11,11.43 30.16,7.62 J1.12A
N$116
  Bottom 0.254: R8.4 32.38,11.43 33.02,7.3 J1.13A
N$117
  Bottom 0.254: R8.3 33.66,11.43 35.88,7.3 J1.14A
N$118
  Bottom 0.254: R8.2 34.92,11.43 38.1,7.94 J1.15A
N$119
  Bottom 0.254: R8.1 36.2,11.43 40.64,7.94 J1.16A
N$120
  Top 0.254: R9.1 47.62,11.43 42.86,7.94 J1.17B
N$121
  Top 0.254: R9.2 48.9,11.43 45.4,7.94 J1.18B
N$122
  Top 0.254: R9.3 50.16,11.43 47.62,7.3 J1.19B
N$123
  Top 0.254: R9.4 51.44,11.43 50.48,7.62 J1.20B
N$124
  Top 0.254: R9.5 52.7,11.43 53.34,7.3 J1.21B
N$125
  Top 0.254: R9.6 53.98,11.43 56.2,7.3 J1.22B
N$126
  Top 0.254: R9.7 55.24,11.43 58.42,7.94 J1.23B
N$127
  Top 0.254: R9.8 56.52,11.43 60.96,7.94 J1.24B
N$128
  Top 0.254: R11.1 67.94,11.43 63.18,7.94 J1.25B
N$129
  Top 0.254: R11.2 69.22,11.43 65.72,7.94 J1.26B
N$130
  Top 0.254: R11.3 70.48,11.43 67.94,7.3 J1.27B
N$131
  Top 0.254: R11.4 71.75,11.43 70.8,6.99 J1.28B
N$132
  Top 0.254: R11.5 73.03,11.43 73.66,7.3 J1.29B
N$133
  Top 0.254: R11.6 74.3,11.43 76.52,7.3 J1.30B
N$134
  Top 0.254: R11.7 75.88,11.43 78.74,7.94 J1.31B
N$135
  Top 0.254: R11.8 77.15,11.43 81.28,7.94 J1.32B
N$136
  Top 0.254: R13.1 88.27,11.43 83.5,7.94 J1.33B
N$137
  Top 0.254: R13.2 89.53,11.43 86.04,7.94 J1.34B
N$138
  Top 0.254: R13.3 90.81,11.43 88.27,7.3 J1.35B
N$139
  Top 0.254: R13.4 92.08,11.43 91.12,7.62 J1.36B
N$140
  Top 0.254: R13.8 97.16,11.43 93.66,7.94 J1.37B
N$141
  Bottom 0.254: R10.8 47.62,11.43 42.86,7.94 J1.17A
N$142
  Bottom 0.254: R10.7 48.9,11.43 45.4,7.94 J1.18A
N$143
  Bottom 0.254: R10.6 50.16,11.43 47.62,7.3 J1.19A
N$144
  Bottom 0.254: R10.5 51.44,11.43 50.48,7.62 J1.20A
N$145
  Bottom 0.254: R10.4 52.7,11.43 53.34,7.3 J1.21A
N$146
  Bottom 0.254: R10.3 53.98,11.43 56.2,7.3 J1.22A
N$147
  Bottom 0.254: R10.2 55.24,11.43 58.42,7.94 J1.23A
N$148
  Bottom 0.254: R10.1 56.52,11.43 60.96,7.94 J1.24A
N$149
  Bottom 0.254: R12.8 67.94,11.43 63.18,7.94 J1.25A
N$150
  Bottom 0.254: R12.7 69.22,11.43 65.72,7.94 J1.26A
N$151
  Bottom 0.254: R12.6 70.48,11.43 67.94,7.3 J1.27A
N$152
  Bottom 0.254: R12.5 71.75,11.43 70.8,6.99 J1.28A
N$153
  Bottom 0.254: R12.4 73.03,11.43 73.66,7.3 J1.29A
N$154
  Bottom 0.254: R12.3 74.3,11.43 76.52,7.3 J1.30A
N$155
  Bottom 0.254: R12.2 75.88,11.43 78.74,7.94 J1.31A
N$156
  Bottom 0.254: R12.1 77.15,11.43 81.28,7.94 J1.32A
N$157
  Top 0.254: R13.12 TP1.1
N$158
  Top 0.254: R13.11 TP2.1
N$159
  Top 0.254: R13.10 TP3.1
N$160
  Top 0.254: R13.5 TP4.1
N$161
  Top 0.254: R13.6 TP5.1
N$162
  Top 0.254: R13.7 TP6.1
VCC
  Top 0.254: X1.4 X1.2 6.99,62.55 6.99,59.69 LED1.A
VDD
  Top 0.254: C1.2 U1.28 15.88,42.32 | C2.2 U2.28 36.23,42.23 | C3.2 U3.28 56.52,42.32 | C4.2 U4.28 76.2,42.23 76.83,41.91 76.83,40.64 75.88,40.32 U4.25 | C5.2 U5.24 97.85,43.81 97.85,52.7 R3.2 | U2.1 15.88,42.32 | U3.2 36.23,42.23 | 56.52,42.32 U4.1 U4.2 | U1.25 14.92,40.32 15.88,40.64 15.88,42.32 | U2.25 35.24,40.32 36.2,40.64 36.23,42.23 | U3.25 55.56,40.32 56.52,40.64 56.52,42.32 | R2.2 R3.2 | R3.2 R4.2
  pour Bottom (isolate 0.254): 6.99,62.87 6.99,45.72 95.25,45.72 95.25,49.53 88.9,49.53 88.9,58.42 30.16,58.42 30.16,62.87

### Text on the board
tNames: Board # | VDD | SDA | SCL | GND | VDD | GND | GND
tStop: IBM 1620 Jr. Project, CHM 2019 / LED Driver & Switch Sensor Board
tDocu: IBM 1620 Jr. Project, CHM 2019 / LED Driver & Switch Sensor Board